# EAGLE design reloadpro (EAGLE 7.3.0)
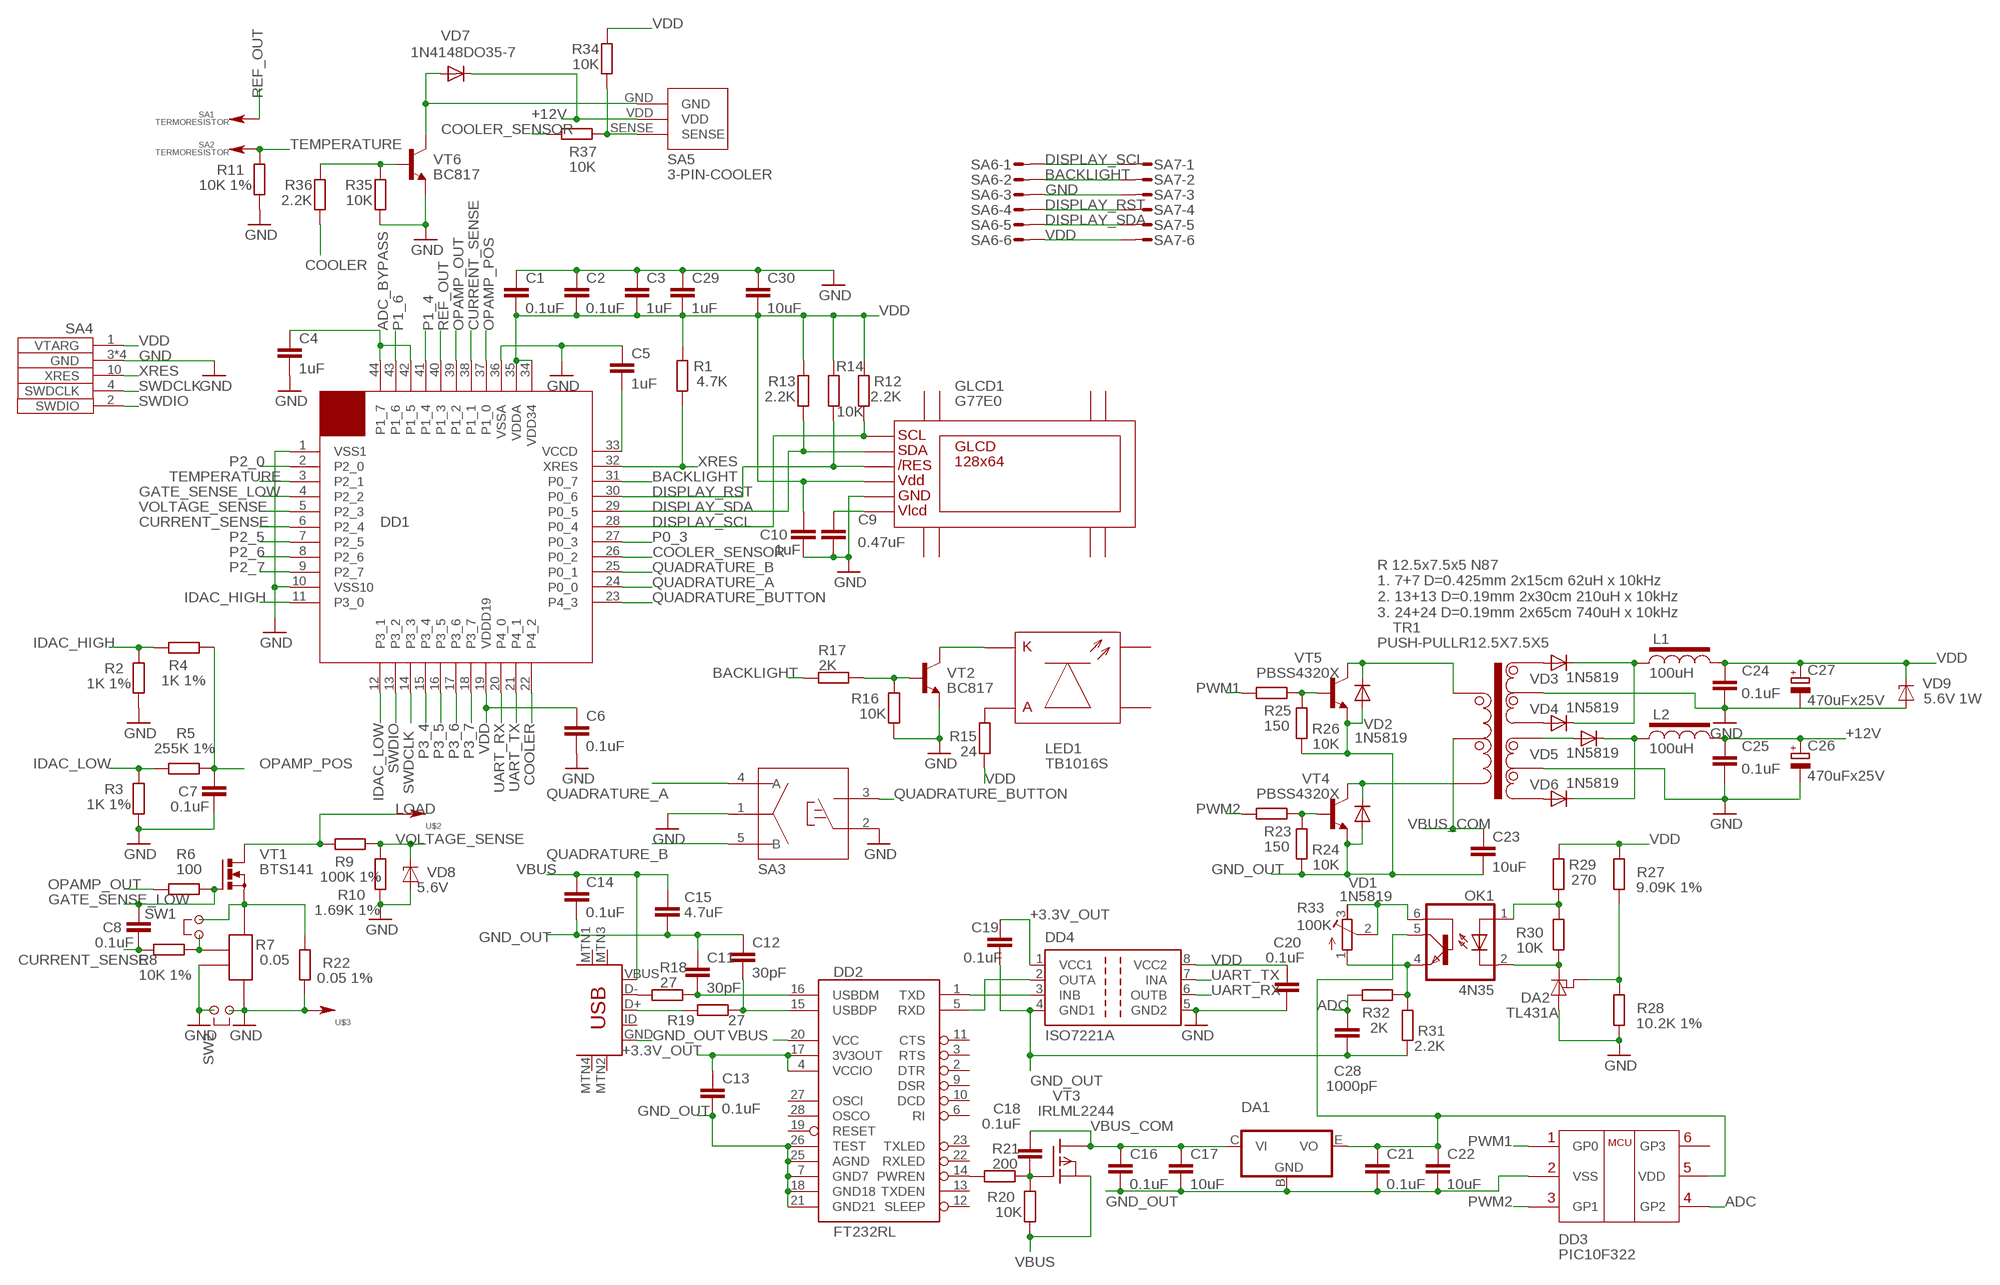
[diagram p0: schematic, sheet 1]

## Parts
C1  0.1uF  C-EUC0603  [C0603]
C2  0.1uF  C-EUC0603  [C0603]
C3  1uF  C-EUC0603  [C0603]
C4  1uF  C-EUC0603  [C0603]
C5  1uF  C-EUC0603  [C0603]
C6  0.1uF  C-EUC0603  [C0603]
C7  0.1uF  C-EUC0603  [C0603]
C8  0.1uF  C-EUC0603  [C0603]
C9  0.47uF  C-EUC1206  [C1206]
C10  1uF  C-EUC0603  [C0603]
C11  30pF  C-EUC0603  [C0603]
C12  30pF  C-EUC0603  [C0603]
C13  0.1uF  C-EUC0603  [C0603]
C14  0.1uF  C-EUC0603  [C0603]
C15  4.7uF  C-EUC0805  [C0805]
C16  0.1uF  C-EUC0603  [C0603]
C17  10uF  C-EUC1206  [C1206]
C18  0.1uF  C-EUC0603  [C0603]
C19  0.1uF  C-EUC0603  [C0603]
C20  0.1uF  C-EUC0603  [C0603]
C21  0.1uF  C-EUC0603  [C0603]
C22  10uF  C-EUC1206  [C1206]
C23  10uF  C-EUC1206  [C1206]
C24  0.1uF  C-EUC0603  [C0603]
C25  0.1uF  C-EUC0805  [C0805]
C26  470uFx25V  CPOL-EUE3.5-8  [E3,5-8]
C27  470uFx25V  CPOL-EUE3.5-8  [E3,5-8]
C28  1000pF  C-EUC0805  [C0805]
C29  1uF  C-EUC0603  [C0603]
C30  10uF  C-EUC0805  [C0805]
DA1  78GOR  [TO92-EBC]
DA2  TL431A  TL431TO92  [TO92-EBC]
DD1  CY8C4245-AXITQFP44  [TQFP44]
DD2  FT232RL  FT232RLSSOP  [SSOP28DB]
DD3  PIC10F322  PIC10F20XSOT23-6  [SOT23-6]
DD4  ISO7221A  [SO-08]
GLCD1  G77E0  [G77E0]
L1  100uH  INDUCTORLGA0410_HOME  [LGA0410]
L2  100uH  INDUCTORLGA0410_HOME  [LGA0410]
LED1  TB1016S  [TB1016S]
OK1  4N35  [DIL06]
R1  4.7K  R-EU_R0603  [R0603]
R2  1K 1%  R-EU_R0603  [R0603]
R3  1K 1%  R-EU_R0603  [R0603]
R4  1K 1%  R-EU_R0603  [R0603]
R5  255K 1%  R-EU_R0805  [R0805]
R6  100  R-EU_R0805  [R0805]
R7  0.05  SR10SR10  [SR10]
R8  10K 1%  R-EU_R0603  [R0603]
R9  100K 1%  R-EU_R0603  [R0603]
R10  1.69K 1%  R-EU_R0805  [R0805]
R11  10K 1%  R-EU_R0603  [R0603]
R12  2.2K  R-EU_R0603  [R0603]
R13  2.2K  R-EU_R0603  [R0603]
R14  10K  R-EU_R0603  [R0603]
R15  24  R-EU_R1206  [R1206]
R16  10K  R-EU_R0603  [R0603]
R17  2K  R-EU_R0603  [R0603]
R18  27  R-EU_R0805  [R0805]
R19  27  R-EU_R0805  [R0805]
R20  10K  R-EU_R0603  [R0603]
R21  200  R-EU_R0603  [R0603]
R22  0.05 1%  R-EU_R2512  [R2512]
R23  150  R-EU_R0805  [R0805]
R24  10K  R-EU_R0603  [R0603]
R25  150  R-EU_R0805  [R0805]
R26  10K  R-EU_R0603  [R0603]
R27  9.09K 1%  R-EU_R0805  [R0805]
R28  10.2K 1%  R-EU_R0805  [R0805]
R29  270  R-EU_R0805  [R0805]
R30  10K  R-EU_R0603  [R0603]
R31  2.2K  R-EU_R0603  [R0603]
R32  2K  R-EU_R0603  [R0603]
R33  100K  R-TRIMM3296H  [RTRIM3296H]
R34  10K  R-EU_R0603  [R0603]
R35  10K  R-EU_R0603  [R0603]
R36  2.2K  R-EU_R0603  [R0603]
R37  10K  R-EU_R0603  [R0603]
SA1  TERMORESISTOR  1-PINHOME  [1-PIN_HOME]
SA2  TERMORESISTOR  1-PINHOME  [1-PIN_HOME]
SA3  PEC16IDC  [PEC16-IDC]
SA4  SWDSMD  [IDC10_1.27SMD]
SA5  3-PIN-COOLER  [3-PIN-COOLER]
SA6  MICROMATCH-6SMD  [MICROMATCH-6SMD]
SA7  MICROMATCH-6SMD  [MICROMATCH-6SMD]
SW1  2-PINDIL  [2-PIN]
SW2  2-PINDIL  [2-PIN]
TR1  PUSH-PULLR12.5X7.5X5  [R12.5X7.5X5PUSHH-PULL]
U$1  USB-MINIB-5PIN  [USB-MINIB]
U$2  1-PIN2_54  [1_PIN_2_54]
U$3  1-PIN2_54  [1_PIN_2_54]
VD1  1N5819  SM5819DO41-10  [DO41-10]
VD2  1N5819  SM5819DO41-10  [DO41-10]
VD3  1N5819  SM5819DO41-10  [DO41-10]
VD4  1N5819  SM5819DO41-10  [DO41-10]
VD5  1N5819  SM5819DO41-10  [DO41-10]
VD6  1N5819  SM5819DO41-10  [DO41-10]
VD7  1N4148DO35-7  [DO35-7]
VD8  5.6V  STABILITRONSMD  [STABILITRON]
VD9  5.6V 1W  STABILITRONDO35-10  [DO35-10]
VT1  BTS141  [TO220BV]
VT2  BC817  BC817-16LT1-NPN-SOT23-BEC  [SOT23-BEC]
VT3  IRLML2244  P-MOSFETSOT23  [SOT23]
VT4  PBSS4320X  -NPN-SOT89-BCE  [SOT89-BCE]
VT5  PBSS4320X  -NPN-SOT89-BCE  [SOT89-BCE]
VT6  BC817  BC817-16LT1-NPN-SOT23-BEC  [SOT23-BEC]

## Nets
+3.3V_OUT: C13.1 C19.1 DD2.4(VCCIO) DD2.17(3V3OUT) DD4.1(VCC1)
+12V: C25.1 C26.+ L2.P$2(L2) SA5.VDD VD7.C
ADC: C28.1 DD3.4(GP2) R32.1
ADC_BYPASS: C4.1 DD1.42(P1_5) DD1.44(P1_7)
BACKLIGHT: DD1.31(P0_7) R17.2 SA6.2 SA7.2
COOLER: DD1.22(P4_2) R36.1
COOLER_SENSOR: DD1.26(P0_2) R37.2
CURRENT_SENSE: C8.2 DD1.6(P2_4) DD1.38(P1_1) R8.2
DISPLAY_RST: DD1.30(P0_6) GLCD1./RES R14.1 SA6.4 SA7.4
DISPLAY_SCL: DD1.28(P0_4) GLCD1.SCL R12.1 SA6.1 SA7.1
DISPLAY_SDA: DD1.29(P0_5) GLCD1.SDA R13.1 SA6.5 SA7.5
GATE_SENSE_LOW: C8.1 DD1.4(P2_2) R6.1 VT1.G
GND: C1.1 C2.1 C3.1 C4.2 C5.1 C6.2 C7.2 C9.2 C10.2 C20.2 C24.2 C25.2 C26.- C27.- C29.1 C30.1 DA2.B(A) DD1.1(VSS1) DD1.10(VSS10) DD1.36(VSSA) DD4.5(GND2) GLCD1.GND R2.1 R3.1 R7.1 R7.2 R10.2 R11.1 R16.1 R22.2 R28.2 R35.1 SA3.1(C) SA3.2(B2) SA4.3(GND) SA4.5(GND) SA4.7(GND) SA4.9(GND) SA6.3 SA7.3 SW2.1 SW2.2 TR1.W2-COM TR1.W2-COM1(W2-COM) TR1.W3-COM TR1.W3-COM1(W3-COM) U$3.P$1(S) VD8.A VD9.A VT2.E VT6.E
GND_OUT: C11.1 C12.1 C13.2 C14.2 C15.2 C16.2 C17.2 C19.2 C21.2 C22.2 C23.2 C28.2 DA1.B(GND) DD2.7(GND7) DD2.18(GND18) DD2.21(GND21) DD2.25(AGND) DD2.26(TEST) DD3.2(VSS) DD4.4(GND1) R24.1 R26.1 R31.2 U$1.GND VD1.A VD2.A VT4.E VT5.E
IDAC_HIGH: DD1.11(P3_0) R2.2 R4.2
IDAC_LOW: DD1.12(P3_1) R3.2 R5.2
LOAD: R9.2 U$2.P$1(S) VT1.D
N$1: C5.2 DD1.33(VCCD)
N$2: R7.4 R22.1 SW1.2 VT1.S
N$3: R7.3 R8.1 SW1.1
N$4: LED1.A R15.1
N$5: LED1.K VT2.C
N$6: R16.2 R17.1 VT2.B
N$7: R18.1 U$1.D-
N$8: C11.2 DD2.16(USBDM) R18.2
N$9: C9.1 GLCD1.VLCD
N$10: R19.1 U$1.D+
N$11: C12.2 DD2.15(USBDP) R19.2
N$12: DD2.1(TXD) DD4.3(INB)
N$13: DD2.5(RXD) DD4.2(OUTA)
N$15: DD2.14(PWREN) R21.2
N$16: C18.1 R20.2 R21.1 VT3.1(G)
N$17: C21.1 C22.1 DA1.E(VO) DD3.5(VDD) OK1.5(COL)
N$18: R23.2 R24.2 VT4.B
N$19: R34.1 R37.1 SA5.SENSE
N$21: R25.2 R26.2 VT5.B
N$22: TR1.W2-1 VD3.A
N$23: TR1.W2-2 VD4.A
N$24: TR1.W3-2 VD6.A
N$25: TR1.W3-1 VD5.A
N$26: L1.P$1(L1) VD3.C VD4.C
N$27: L2.P$1(L1) VD5.C VD6.C
N$28: DA2.E(REF) R27.2 R28.1
N$29: OK1.1(A) R29.2 R30.1
N$30: DA2.C OK1.2(C) R30.2
N$31: OK1.4(EMI) R31.1 R32.2 R33.1(E)
N$32: OK1.6(BAS) R33.2(S) R33.3(A)
N$33: R35.2 R36.2 VT6.B
N$34: SA5.GND VD7.A VT6.C
OPAMP_OUT: DD1.39(P1_2) R6.2
OPAMP_POS: C7.1 DD1.37(P1_0) R4.1 R5.1
P0_3: DD1.27(P0_3)
P1_4: DD1.41(P1_4)
P1_6: DD1.43(P1_6)
P2_0: DD1.2(P2_0)
P2_5: DD1.7(P2_5)
P2_6: DD1.8(P2_6)
P2_7: DD1.9(P2_7)
P3_4: DD1.15(P3_4)
P3_5: DD1.16(P3_5)
P3_6: DD1.17(P3_6)
P3_7: DD1.18(P3_7)
PWM1: DD3.1(GP0) R25.1
PWM1PWR: TR1.W1-1 VD2.C VT5.C
PWM2: DD3.3(GP1) R23.1
PWM2PWR: TR1.W1-2 VD1.C VT4.C
QUADRATURE_A: DD1.24(P0_0) SA3.4(A)
QUADRATURE_B: DD1.25(P0_1) SA3.5(B)
QUADRATURE_BUTTON: DD1.23(P4_3) SA3.3(B1)
REF_OUT: DD1.40(P1_3) SA1.P$1(S)
SWDCLK: DD1.14(P3_3) SA4.4(SWDCLK)
SWDIO: DD1.13(P3_2) SA4.2(SWDIO)
TEMPERATURE: DD1.3(P2_1) R11.2 SA2.P$1(S)
UART_RX: DD1.20(P4_0) DD4.6(OUTB)
UART_TX: DD1.21(P4_1) DD4.7(INA)
VBUS: C14.1 C15.1 DD2.20(VCC) R20.1 U$1.VBUS VT3.2(S)
VBUS_COM: C16.1 C17.1 C18.2 C23.1 DA1.C(VI) TR1.W1-COM TR1.W1-COM1(W1-COM) VT3.3(D)
VDD: C1.2 C2.2 C3.2 C6.1 C10.1 C20.1 C24.1 C27.+ C29.2 C30.2 DD1.19(VDDD19) DD1.34(VDD34) DD1.35(VDDA) DD4.8(VCC2) GLCD1.VDD L1.P$2(L2) R1.2 R12.2 R13.2 R14.2 R15.2 R27.1 R29.1 R34.2 SA4.1(VTARG) SA6.6 SA7.6 VD9.C
VOLTAGE_SENSE: DD1.5(P2_3) R9.1 R10.1 VD8.C
XRES: DD1.32(XRES) R1.1 SA4.10(XRES)
Unconnected: DD2.2(DTR) DD2.3(RTS) DD2.6(RI) DD2.9(DSR) DD2.10(DCD) DD2.11(CTS) DD2.12(SLEEP) DD2.13(TXDEN) DD2.19(RESET) DD2.22(RXLED) DD2.23(TXLED) DD2.27(OSCI) DD2.28(OSCO) DD3.6(GP3) GLCD1.NC1 GLCD1.NC2 GLCD1.NC3 GLCD1.NC4 GLCD1.NC5 GLCD1.NC6 GLCD1.NC7 GLCD1.NC8 LED1.NC1 LED1.NC2 U$1.ID U$1.MTN1(MTN2) U$1.MTN2(MTN3) U$1.MTN3(MTN1) U$1.MTN4

## Notes on the sheet
- R 12.5x7.5x5 N87
  1. 7+7 D=0.425mm 2x15cm 62uH x 10kHz
  2. 13+13 D=0.19mm 2x30cm 210uH x 10kHz
  3. 24+24 D=0.19mm 2x65cm 740uH x 10kHz

## Library data of the parts
C1-C25 C28-C30 = resistors:C-EU: CAPACITOR, European symbol
C26 C27 = resistors:CPOL-EU: POLARIZED CAPACITOR, European symbol
DA1 = power:78*: Positive VOLTAGE REGULATOR Source: http://cache.national.com/ds/LM/LM78L05.pdf http://www.fairchildsemi.com/ds/LM/LM7805.pdf
DA2 = power:TL431
DD1 = cypress:CY8C4245-AXI
DD2 = interface_ic:FT232RL: FT232RL USB UART FT232RL 4th Generation USB UART (USB <-> Serial) Controller. Datasheet <http://www.sparkfun.com/datasheets/IC/FT232R_v104.pdf> SparkFun Products Component <https://www.sparkfun.com/products/650> (COM-00650) SparkFun RedBot Mainboard <https://www.sparkfun.com/products/12097> (ROB-12097) SparkFun FTDI Basic Breakout - 5V <https://www.sparkfun.com/products/9716> (DEV-09716) SparkFun FTDI Basic Breakout - 3.3V <https://www.sparkfun.com/products/9873> (DEV-09873) Bus Pirate - v3.6a <https://www.sparkfun.com/products/12942> (TOL-12942) SparkFun USB to Serial Breakout - FT232RL <https://www.sparkfun.com/products/12731> (BOB-12731) SparkFun PicoBoard <https://www.sparkfun.com/products/11888> (WIG-11888) SparkFun RFID USB Reader <https://www.sparkfun.com/products/9963> (SEN-09963) LilyPad FTDI Basic Breakout - 5V <https://www.sparkfun.com/products/10275> (DEV-10275) SparkFun Stepoko <https://www.sparkfun.com/products/13899> (ROB-13899); PROD_ID: IC-00870
DD3 = Microchip:PIC10F20X
DD4 = texas:ISO7221: DUAL DIGITAL ISOLATORS Source: http://focus.ti.com/lit/ds/symlink/iso7221a.pdf; MPN: ISO7221AD; OC_FARNELL: 1390651; OC_NEWARK: 48M0672
GLCD1 = lcd:G77E0
L1 L2 = inductors:INDUCTOR
LED1 = lcd:TB1016S
OK1 = optocoupler:4N35: MOTOROLA OPTO COUPLER; MF: FAIRCHILD SEMICONDUCTOR; MPN: 4N35; OC_FARNELL: 1328375; OC_NEWARK: 72K9946
R1-R6 R8-R32 R34-R37 = resistors:R-EU_: RESISTOR, European symbol
R7 = resistors:SR10
R33 = resistors:R-TRIMM: Trimm resistor
SA1 SA2 U$2 U$3 = connectors:1-PIN
SA3 = encoders:PEC16
SA4 = cypress:SWD
SA5 = connectors:3-PIN-COOLER
SA6 SA7 = connectors:MICROMATCH-6: MicroMaTch 6 7-215464-6 / 0-215464-6 Drawing Number C-215464 DDEController.pdf
SW1 SW2 = connectors:2-PIN
TR1 = inductors:PUSH-PULLR12.5X7.5X5
U$1 = connectors:USB-MINIB: Mini-USB "B" connector with 5th pin broken out. Created new symbol breaking out 5th "ID" pin in mini/micro USB connector spec. See: http://en.wikipedia.org/wiki/Mini_usb#Cables. Uses same footprint as 4-pin symbol. Also added pins to connect to mounting / shield pads if required (probably not generally needed as signals aren't shielded once they leave the connector).
VD1-VD6 = diodes:SM5819
VD7 = diodes:1N4148: DIODE high speed (Philips)
VD8 VD9 = diodes:STABILITRON
VT1 = Tranzistors:BTS141
VT2 VT4-VT6 = Tranzistors:*-NPN-: NPN Transistror BF959 corrected 2008.03.06
VT3 = Tranzistors:P-MOSFET

## Board
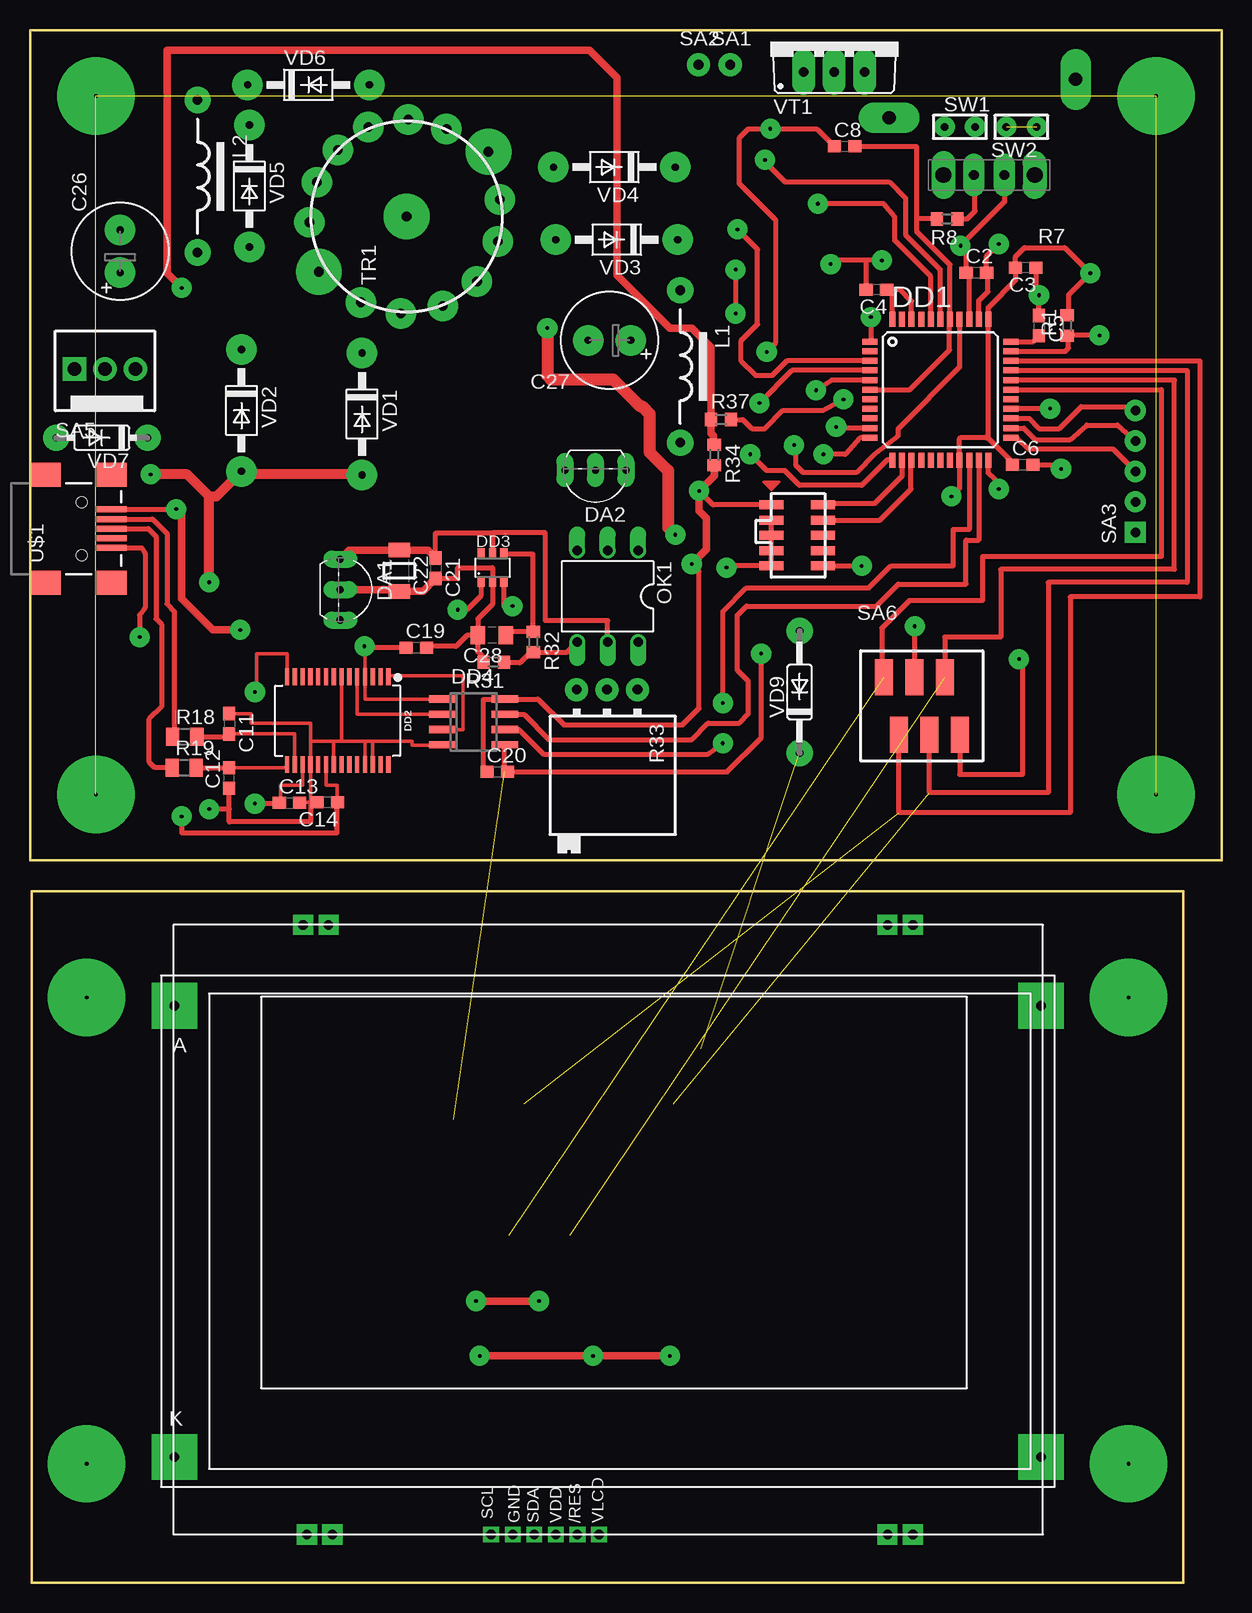
[diagram p1: board, top side]
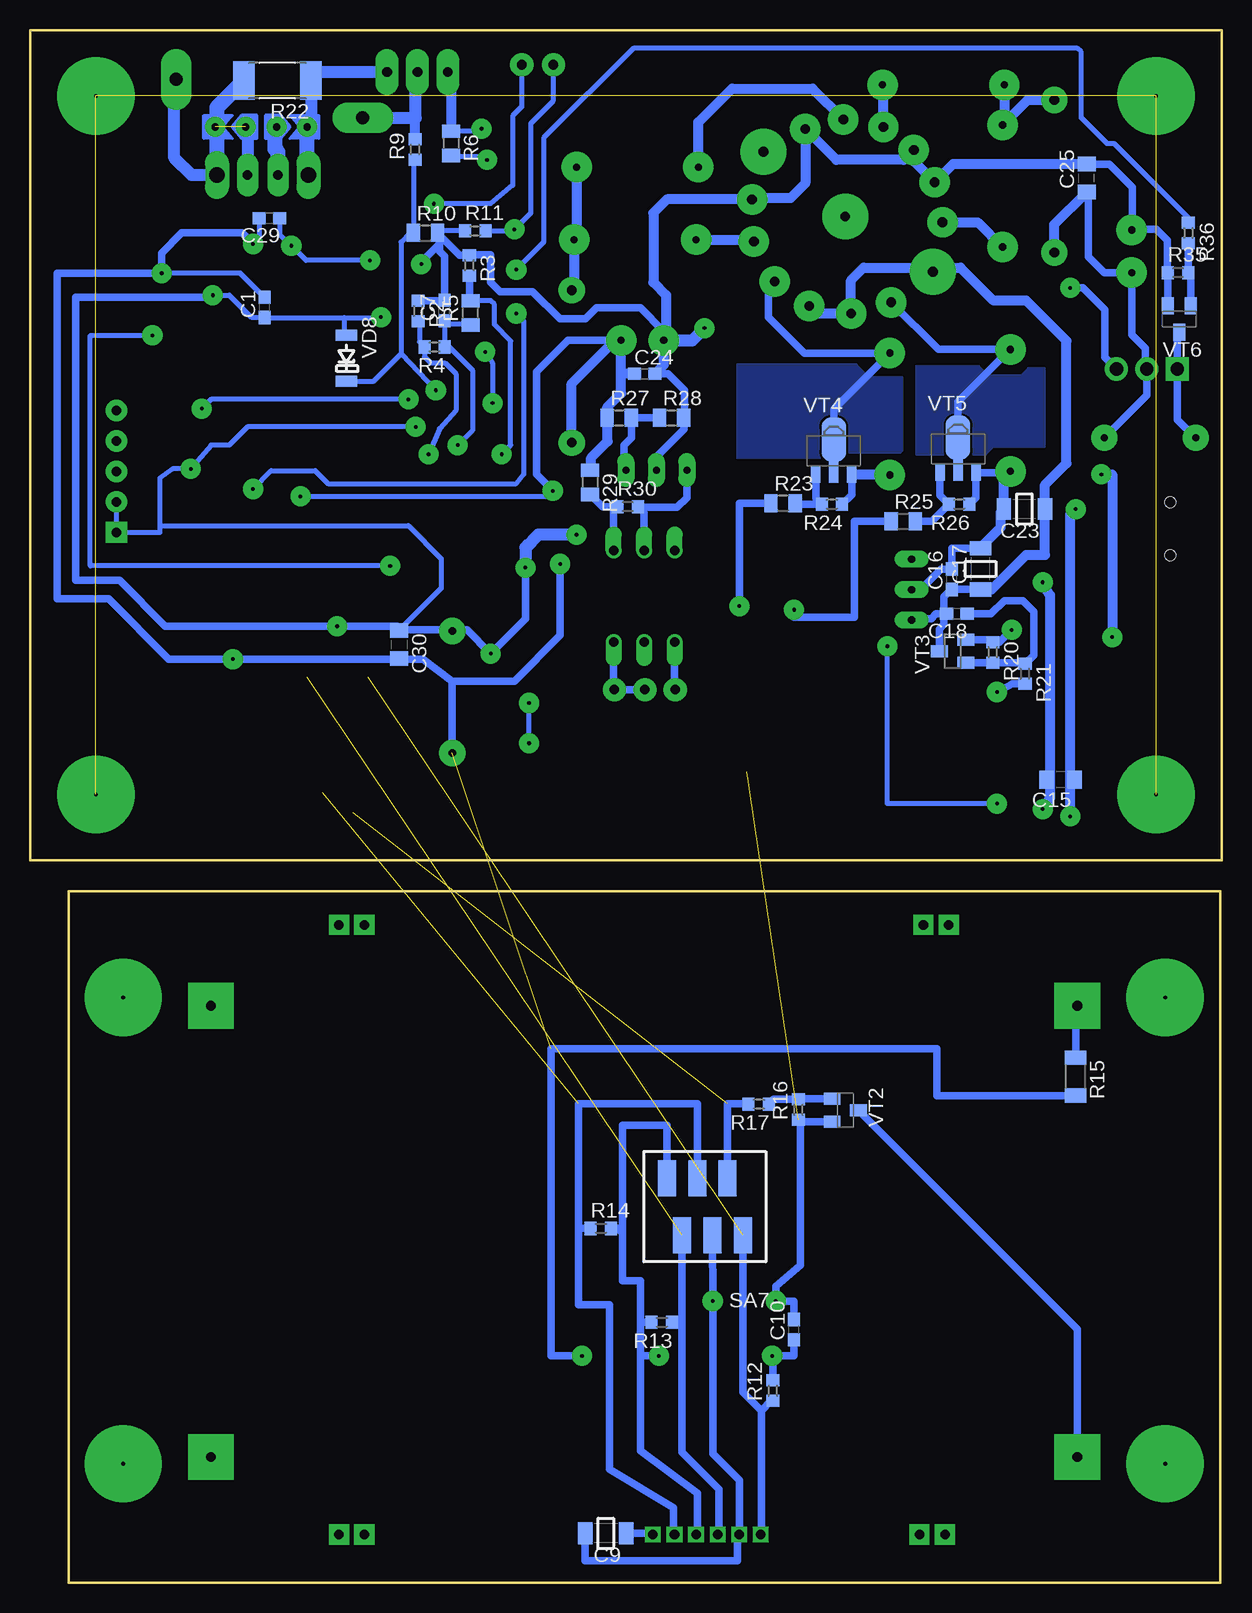
[diagram p2: board, bottom side, seen from below]

Size 99.36 x 129.39 mm. Coordinates in mm from the lower left corner, seen from the top.
Outline: 0.15,0 96.14,0 96.14,57.63 0.15,57.63 0.15,0
Outline: 0,129.39 99.36,129.39 99.36,60.2 0,60.2 0,129.39
Copper layers (1*16): Top 0.035mm / dielectric 1.5mm / Bottom 0.035mm
Design rules "default *": minimum track width 10mil, minimum drill 24mil, track to track 8mil, track to pad 8mil, pad to pad 8mil, via to via 8mil, smd to smd 8mil, copper to edge 40mil, drill to drill 8mil, minimum pad ring 10mil, minimum via ring 8mil, stop-mask expansion 4mil, vias tented up to drill 0mil, thermal gap 10mil

### Footprints (pad centres in the part's own frame; a part is rotated, then mirrored left to right if it is on the bottom)
C0603 = smd 1.1 x 1: 1 -0.85,0; 2 0.85,0
C1206 = smd 1.2 x 1.8: 1 -1.718,0; 2 1.718,0
C0805 = smd 1.2 x 1.5: 1 -1.167,0; 2 1.167,0
E3,5-8 = drill 0.6 pad 2.54: + -1.778,0; - 1.778,0
TO92-EBC = drill 0.6 pad 1.422 long: B 0,-1.27; C 2.54,-1.27; E -2.54,-1.27
TQFP44 = smd 1.25 x 0.5: 1 -5.879,4; 2 -5.879,3.2; 3 -5.879,2.4; 4 -5.879,1.6; 5 -5.879,0.8; 6 -5.879,0; 7 -5.879,-0.8; 8 -5.879,-1.6; 9 -5.879,-2.4; 10 -5.879,-3.2; 11 -5.879,-4; 23 5.879,-4; 24 5.879,-3.2; 25 5.879,-2.4; 26 5.879,-1.6; 27 5.879,-0.8; 28 5.879,0; 29 5.879,0.8; 30 5.879,1.6; 31 5.879,2.4; 32 5.879,3.2; 33 5.879,4 | smd 0.5 x 1.25: 12 -4,-5.879; 13 -3.2,-5.879; 14 -2.4,-5.879; 15 -1.6,-5.879; 16 -0.8,-5.879; 17 0,-5.879; 18 0.8,-5.879; 19 1.6,-5.879; 20 2.4,-5.879; 21 3.2,-5.879; 22 4,-5.879; 34 4,5.879; 35 3.2,5.879; 36 2.4,5.879; 37 1.6,5.879; 38 0.8,5.879; 39 0,5.879; 40 -0.8,5.879; 41 -1.6,5.879; 42 -2.4,5.879; 43 -3.2,5.879; 44 -4,5.879
SSOP28DB = smd 0.348 x 1.397: 1 -4.225,-3.656; 2 -3.575,-3.656; 3 -2.925,-3.656; 4 -2.275,-3.656; 5 -1.625,-3.656; 6 -0.975,-3.656; 7 -0.325,-3.656; 8 0.325,-3.656; 9 0.975,-3.656; 10 1.625,-3.656; 11 2.275,-3.656; 12 2.925,-3.656; 13 3.575,-3.656; 14 4.225,-3.656; 15 4.225,3.656; 16 3.575,3.656; 17 2.925,3.656; 18 2.275,3.656; 19 1.625,3.656; 20 0.975,3.656; 21 0.325,3.656; 22 -0.325,3.656; 23 -0.975,3.656; 24 -1.625,3.656; 25 -2.275,3.656; 26 -2.925,3.656; 27 -3.575,3.656; 28 -4.225,3.656
SOT23-6 = smd 0.6 x 0.9: 1 -0.95,-1.15; 2 0,-1.15; 3 0.95,-1.15; 4 0.95,1.15; 5 0,1.15; 6 -0.95,1.15
SO-08 = smd 0.6 x 2.2: 1 -1.905,-2.6; 2 -0.635,-2.6; 3 0.635,-2.6; 4 1.905,-2.6; 5 1.905,2.6; 6 0.635,2.6; 7 -0.635,2.6; 8 -1.905,2.6
G77E0 = drill 0.8 pad 1.27 square: /RES 33.7,0; GND 28.3,0; SCL 26.5,0; SDA 30.1,0; VDD 31.9,0; VLCD 35.5,0 | drill 0.8 pad 1.676 square: NC1 10.832,50.8; NC2 12.95,50.8; NC3 59.55,50.8; NC4 61.667,50.8; NC5 11.15,0; NC6 13.268,0; NC7 59.55,0; NC8 61.667,0
LGA0410 = drill 0.8 pad 2.184: P$1 0,0; P$2 12.7,0
TB1016S = drill 0.8 pad 3.81 square: A 1.13,40.1; K 1.13,2.5; NC1 73.37,40.1; NC2 73.37,2.5
DIL06 = drill 0.813 offset: 1 -2.54,-3.81; 2 0,-3.81; 3 2.54,-3.81; 4 2.54,3.81; 5 0,3.81; 6 -2.54,3.81
R0603 = smd 1 x 1.1: 1 -0.85,0; 2 0.85,0
R0805 = smd 1.1 x 1.5: 1 -1.009,0; 2 1.009,0
SR10 = drill 1.3 pad 2 long: 1 -3.81,0; 4 3.81,0 | drill 0.8 pad 1.778 long: 2 -1.27,0; 3 1.27,0
R1206 = smd 1.2 x 1.803: 1 -1.581,0; 2 1.581,0
R2512 = smd 1.8 x 3.2: 1 -2.8,0; 2 2.8,0
RTRIM3296H = drill 0.8 pad 1.93: 1 0,0; 2 0,2.54; 3 0,5.08
1-PIN_HOME = drill 0.8 pad 1.93: P$1 0,0
PEC16-IDC = drill 0.8 pad 1.778 square: 1 0,0 | drill 0.8 pad 1.778: 2 2.54,0; 3 5.08,0; 4 7.62,0; 5 10.16,0
IDC10_1.27SMD = smd 0.75 x 2: 1 5.08,4.128; 2 5.08,-0.159; 3 3.81,4.128; 4 3.81,-0.159; 5 2.54,4.128; 6 2.54,-0.159; 7 1.27,4.128; 8 1.27,-0.159; 9 0,4.128; 10 0,-0.159
3-PIN-COOLER = drill 1.1 pad 1.93 square: GND 0,0 | drill 1.1 pad 1.93: SENSE 5.08,0; VDD 2.54,0
MICROMATCH-6SMD = smd 1.5 x 3: 1 0,0; 2 1.27,-4.763; 3 2.54,0; 4 3.81,-4.763; 5 5.08,0; 6 6.35,-4.763
2-PIN = drill 0.6 pad 1.676: 1 0,0; 2 2.54,0
R12.5X7.5X5PUSHH-PULL = drill 0.8 pad 3.81: P$1 0,0; P$2 5.397,-6.826; P$3 -4.604,7.303 | drill 0.8 pad 2.54: W1-1 -7.144,3.81; W1-2 -5.397,-5.874; W1-COM -8.096,0.476; W1-COM1 -7.461,-3.016; W2-1 -2.064,-7.62; W2-2 8.096,-0.159; W2-COM 1.429,-7.779; W2-COM1 7.303,-3.334; W3-1 -0.476,8.096; W3-2 7.461,3.175; W3-COM 2.857,7.461; W3-COM1 5.556,5.715
USB-MINIB = smd 2.5 x 0.5: D+ 2.5,0; D- 2.5,0.8; GND 2.5,-1.6; ID 2.5,-0.8; VBUS 2.5,1.6 | smd 2.5 x 2: MTN1 -3,4.5; MTN2 2.5,4.5; MTN3 -3,-4.5; MTN4 2.5,-4.5 | hole 0.9: 0,2.2; 0,-2.2
1_PIN_2_54 = drill 1.1 pad 2.54 long: P$1 0,0
DO41-10 = drill 0.6 pad 2.54: A 5.08,0; C -5.08,0
DO35-7 = drill 0.6 pad 2.184: A 3.81,0; C -3.81,0
STABILITRON = smd 0.914 x 1.778: A 0,0; C 3.81,0
DO35-10 = drill 0.6 pad 2.184: A 5.08,0; C -5.08,0
TO220BV = drill 0.8 pad 1.93 long: D 0,-2.54; G -2.54,-2.54; S 2.54,-2.54
SOT23-BEC = smd 1 x 1.4: B -0.95,-1.1; C 0,1.1; E 0.95,-1.1
SOT23 = smd 1 x 1.4: 1 -0.95,-1.1; 2 0.95,-1.1; 3 0,1.1
SOT89-BCE = smd 0.8 x 1.4: B -1.499,-1.981; E 1.499,-1.981 | smd 0.8 x 1.9: C 0,-1.727 | smd 2.032 x 3.65: C@1 0,0.94

### Placement (x,y rotation side)
C1  79.81,106.27 90 bottom
C2  78.89,109.17 0 top
C3  83.01,109.58 180 top
C4  70.56,107.75 180 top
C5  84.12,104.75 270 top
C6  82.75,93.17 0 top
C7  64.82,106.02 90 bottom
C8  67.92,119.68 0 top
C9  51.36,4.11 180 bottom
C10  35.66,21.08 90 bottom
C11  16.61,71.58 270 top
C12  16.61,67.06 90 top
C13  21.64,64.97 0 top
C14  24.79,65.02 180 top
C15  13.44,66.9 180 bottom
C16  22.5,83.62 90 bottom
C17  20.12,84.48 90 bottom
C18  22.1,80.72 180 bottom
C19  32.21,77.93 0 top
C20  38.96,67.56 0 top
C21  33.83,84.53 270 top
C22  30.78,84.33 270 top
C23  16.46,89.46 180 bottom
C24  48.11,100.74 0 bottom
C25  11.28,117.04 90 bottom
C26  7.52,110.95 90 top
C27  48.31,103.53 180 top
C28  38.51,78.94 180 top
C29  79.4,113.69 180 bottom
C30  68.58,78.18 270 bottom
DA1  27.13,82.75 270 top
DA2  47.14,91.44 180 top
DD1  75.9,99.42 0 top
DD2  25.65,71.83 180 top
DD3  38.56,84.58 0 top
DD4  36.98,71.73 270 top
GLCD1  11.94,4.01 0 top
L1  54.2,107.7 270 top
L2  13.97,123.55 270 top
LED1  10.92,7.98 0 top
OK1  48.16,82.19 180 top
R1  86.46,104.75 90 top
R2  67.01,105.97 270 bottom
R3  62.74,109.78 270 bottom
R4  65.63,102.97 180 bottom
R5  62.64,105.82 90 bottom
R6  64.26,119.94 270 bottom
R7  79.96,117.3 180 top
R8  76.45,113.64 180 top
R9  67.26,119.43 90 bottom
R10  66.4,112.47 0 bottom
R11  62.24,112.65 0 bottom
R12  37.44,16 90 bottom
R13  46.69,21.69 180 bottom
R14  51.77,29.51 0 bottom
R15  12.19,42.16 270 bottom
R16  35.31,39.42 90 bottom
R17  38.61,39.88 180 bottom
R18  12.9,70.51 0 top
R19  12.85,67.92 0 top
R20  19.1,77.52 270 bottom
R21  16.41,75.74 270 bottom
R22  78.74,125.17 180 bottom
R23  36.58,89.97 0 bottom
R24  32.51,89.87 180 bottom
R25  26.57,88.44 0 bottom
R26  21.89,89.87 180 bottom
R27  50.24,97.08 0 bottom
R28  45.87,97.08 0 bottom
R29  52.68,91.69 270 bottom
R30  49.53,89.66 0 bottom
R31  38.66,76.71 180 top
R32  41.96,78.38 270 top
R33  45.57,74.42 270 top
R34  57.05,93.98 270 top
R35  3.66,109.17 0 bottom
R36  2.79,112.47 270 bottom
R37  57.61,96.93 0 top
SA1  58.37,126.49 0 top
SA2  55.73,126.49 0 top
SA3  92.15,87.53 90 top
SA4  65.94,84.73 90 top
SA5  3.71,101.14 0 top
SA6  71.17,75.44 0 top
SA7  39.93,28.96 180 bottom
SW1  78.79,121.31 180 top
SW2  81.38,121.31 0 top
TR1  31.39,113.84 90 top
U$1  4.32,87.83 0 top
U$2  71.63,122.07 90 top
U$3  87.17,125.27 180 top
VD1  27.69,97.38 270 top
VD2  17.63,97.69 270 top
VD3  48.92,111.91 180 top
VD4  48.72,117.96 180 top
VD5  18.29,116.38 270 top
VD6  23.22,124.82 0 top
VD7  5.99,95.4 180 top
VD8  73,103.94 270 bottom
VD9  64.16,74.22 90 top
VT1  67.06,128.42 0 top
VT2  31.39,39.37 270 bottom
VT3  22.45,77.62 90 bottom
VT4  32.36,94.34 0 bottom
VT5  22,94.49 0 bottom
VT6  3.56,105.31 180 bottom

### Tracks (layer width: path | path; a pad name or v marks a point on that pad's centre or on a via)
+3.3V_OUT  (via drill 0.3 pad 1.68)
  Top 0.305: DD4.1 27.93,73.64 DD2.4 27.93,78.03 v27.89,78.03 | DD2.17 22.73,66.45 20.88,66.45 20.88,64.97 C13.1
  Top 0.406: C13.1 20.79,64.92 v18.75,64.92 | C19.1 27.99,77.93 v27.89,78.03
  Bottom 0.406: v18.75,64.92 27.89,64.92 v27.89,78.03
+12V
  Bottom 0.61: C25.1 11.13,115.72 11.13,110.49 9.8,109.17 C26.+ 7.52,103.99 6.4,102.87 6.4,101.3 SA5.VDD 6.25,98.96 VD7.C
  Bottom 0.813: L2.P$2 13.97,113.18 C25.1
ADC
  Top 0.406: DD3.4 41.91,85.73 41.91,79.28 R32.1 39.97,79.23 C28.1
ADC_BYPASS
  Top 0.406: DD1.44 71.9,107.26 C4.1 72.54,107.75 73.5,106.79 DD1.42
BACKLIGHT  (1 unrouted)
  Top 0.406: DD1.31 97.54,101.82 97.54,82.14 86.72,82.14 86.72,64.16 72.44,64.16 SA6.2
  Bottom 0.61: SA7.2 41.2,39.93 39.46,39.93 R17.2
COOLER  (via drill 0.3 pad 1.68)
  Top 0.406: v80.77,91.14 80.47,91.9 79.9,92.47 DD1.22 | v58.83,109.42 v58.83,105.77
  Bottom 0.406: v80.77,91.14 79.25,92.66 75.59,92.66 74.52,91.59 58.83,91.59 58.22,92.35 58.22,105.16 v58.83,105.77 | v58.83,109.42 56.54,111.71 56.54,120.4 49.07,127.86 12.04,127.86 11.73,127.56 11.73,122.07 9.6,119.94 8.99,119.94 2.79,113.74 R36.1
COOLER_SENSOR  (via drill 0.3 pad 1.68)
  Top 0.406: v85.04,97.84 81.8,97.84 DD1.26 | v67.82,98.6 66.14,97.69 62.79,97.69 61.26,96.16 60.2,96.16 59.44,96.93 R37.2
  Bottom 0.406: v67.82,98.6 84.28,98.6 v85.04,97.84
CURRENT_SENSE
  Top 0.406: DD1.6 73.36,99.42 76.66,102.72 76.66,105.26 DD1.38 76.7,109.84 73.91,112.62 73.91,113.69 | C8.2 73.91,119.69 73.91,113.69 | R8.2 73.96,113.64 73.91,113.69
DISPLAY_RST  (1 unrouted)
  Top 0.406: DD1.30 96.47,101.02 96.47,83.36 84.89,83.36 84.89,65.84 74.98,65.84 SA6.4
  Bottom 0.61: SA7.4 43.74,39.93 53.64,39.93 53.64,29.57 | 53.64,29.57 53.64,23.16 51.05,23.16 51.05,9.45 45.72,6.25 45.72,4.09 GLCD1./RES | R14.1 53.59,29.52 53.64,29.57
DISPLAY_SCL  (1 unrouted)
  Top 0.406: DD1.28 94.34,99.42 94.34,85.5 79.4,85.5 79.4,81.84 73.3,81.84 71.02,79.55 71.02,75.59 SA6.1
  Bottom 0.61: SA7.1 39.93,15.85 38.4,14.33 | 38.4,14.33 38.4,4.05 GLCD1.SCL | R12.1 37.58,15.15 38.4,14.33
DISPLAY_SDA  (1 unrouted)
  Top 0.406: DD1.29 95.4,100.22 95.4,84.43 80.92,84.43 80.92,78.79 76.25,78.79 SA6.5
  Bottom 0.61: SA7.5 45.01,21.64 | 45.01,21.64 45.01,10.87 41.91,7.77 41.91,4.14 GLCD1.SDA | R13.1 45.06,21.69 45.01,21.64
GATE_SENSE_LOW  (via drill 0.3 pad 1.68)
  Top 0.406: DD1.4 63.53,101.02 v60.81,98.3 | v61.42,102.56 62.18,103.33 62.18,113.54 59.13,116.59 59.13,120.4 59.89,121.16 v61.72,121.16 65.6,121.16 C8.1
  Bottom 0.406: v61.42,102.56 60.81,101.65 v60.81,98.3 | v61.72,121.16 61.93,120.95 R6.1
  Bottom 0.813: VT1.G 64.26,125.63 R6.1
GND  (via drill 0.3 pad 1.68)  (2 unrouted)
  Top 0.406: DD4.5 39.58,67.56 C20.2 58.12,67.56 60.96,70.41 v60.96,77.42 | SA4.3 SA4.5 SA4.7 SA4.9 58.22,84.73 v58.06,84.58 | 78.33,105.26 DD1.36 78.3,108.92 C2.1 78.04,110.93 v77.57,111.4 81.23,115.06 R7.2 | C5.1 v84.12,107.29 83.86,107.56 C3.1 | DD1.10 67.31,96.22 v67.21,96.32 | v70.1,105.46 70.1,103.5 DD1.1 | v71.02,110.19 69.65,110.19 | 69.65,110.19 67.06,110.19 v66.75,109.88 | C4.2 69.71,110.12 69.65,110.19 | C6.2 85.6,93.17 v85.95,92.81 | SA6.3 73.76,75.44 v73.76,79.7
  Top 0.61: v42.44,23.47 v37.19,23.47
  Top 1.016: v43.13,104.55 43.13,100.58 43.43,100.28 48.62,100.28 50.9,97.99 51.05,97.99 51.66,97.38 51.66,94.18 53.19,92.66 53.19,87.94 v53.8,87.33
  Bottom 0.406: 88.54,88.09 88.54,92.05 87.48,92.81 v85.95,92.81 84.28,94.79 82.75,94.79 81.23,96.32 v67.21,96.32 | 88.54,88.09 88.54,87.53 SA3.1 SA3.2 | R11.1 65.2,112.65 R10.2 | v71.02,110.19 76.35,110.19 v77.57,111.4 78.55,112.38 C29.1 | 58.06,86.72 58.06,86.26 | 68.73,79.7 68.58,79.55 68.58,79.4 C30.1 65.07,82.85 65.07,85.34 67.82,88.09 88.54,88.09 | v84.12,107.29 82.75,107.29 80.92,105.46 79.84,105.46 C1.1 73.15,105.42 | 73.15,105.42 70.14,105.42 v70.1,105.46 | VD8.A 73.15,103.94 73.15,105.42
  Bottom 0.61: SA7.3 v42.44,23.47 42.44,10.74 40.23,8.53 GLCD1.GND 40.39,4.01 40.39,1.83 53.08,1.83 C9.2 | C10.2 35.66,23.47 v37.19,23.47 37.19,24.69 35.16,26.47 35.16,38.42 | DA2.B 47.09,92.76 47.09,93.88 44.86,96.11 R28.2 44.81,97.14 44.81,99.36 46.18,100.74 C24.2 | C27.- 46.53,104.29 48.46,106.22 52.12,106.22 53.04,105.31 55.17,105.31 57.45,107.59 60.2,107.59 60.96,108.36 60.96,110.64 62.72,110.64 R3.1 63.54,110.63 65,112.09 | C25.2 9.4,118.21 7.47,116.28 7.47,112.78 | 7.47,112.78 C26.- | VT6.E R35.1 4.57,109.23 4.57,111.86 5.49,112.78 7.47,112.78 | SW2.2 83.92,120.24 83.77,120.09 | 65,112.09 R10.2 | R2.1 64.87,106.82 C7.2 64.82,110.54 65.23,110.95 65.23,111.56 | 68.73,79.7 v73.76,79.7 88.09,79.7 91.9,83.52 95.55,83.52 95.55,107.14 84.28,107.14 v84.12,107.29 | v58.06,84.58 58.06,80.31 v60.96,77.42 62.94,79.4 64.16,79.4 | 65.23,111.56 65.23,111.86 65,112.09 | v66.75,109.88 66.75,110.03 65.23,111.56 | 68.58,79.4 64.16,79.4 | R16.1 35.16,38.42 | 35.16,38.42 VT2.E | VD9.A 64.16,79.4
  Bottom 0.813: C24.2 46.53,101.46 C27.- 46.33,103.73 46.33,107.29 47.4,108.36 47.4,114.15 46.27,115.27 TR1.W2-COM 39.08,115.37 35.97,115.37 34.73,116.61 TR1.W2-COM1 32.15,118.57 26.51,118.57 TR1.W3-COM1 25.68,118.45 TR1.W3-COM 22.42,118.21 C25.2
  Bottom 1.016: R7.1 85.9,117.3 87.33,118.72 87.33,125.12 U$3.P$1 | SW2.1 81.23,121.16 R7.2 | C27.- 44.15,103.53 v43.13,104.55 | v53.8,87.33 57,87.33 58.06,86.26 v58.06,84.58
  Bottom 1.27: R7.1 83.77,120.09 83.77,122.94 R22.2
GND_OUT  (via drill 0.3 pad 1.68)
  Top 0.305: C11.1 18.44,72.43 18.44,71.63 23.38,71.63 23.38,70.1 | 23.38,70.1 DD2.18 23.38,65.02 | DD2.21 25.33,70.1 | 25.33,70.1 23.38,70.1 | DD2.26 28.58,70.1 | 28.58,70.1 27.93,70.1 | 27.93,70.1 25.98,70.1 | 25.98,70.1 25.33,70.1 | DD2.25 27.93,70.1 | 28.58,70.1 31.85,70.1 31.85,69.8 34.38,69.8 DD4.4 | DD2.7 25.98,70.1 | C13.2 22.49,65.02 23.38,65.02 | 23.38,65.02 C14.2
  Top 0.406: 16.61,66.27 C12.1 16.61,64.47 | 23.38,65.02 23.38,63.4 16.61,63.4 16.61,64.47 | 16.61,64.47 v14.94,64.47 | C21.2 35.66,83.68 35.66,84.58 38.56,84.58 DD3.2 38.56,81.53 37.34,80.31 C28.2 | U$1.GND 9.32,86.23 9.6,85.8 9.6,81.23 9.14,80.62 v9.14,78.79 | C28.2 36.42,78.94 35.51,78.03 33.16,78.03 C19.2 | R31.2 37.81,77.1 37.34,77.57 C28.2
  Top 0.61: C22.2 | C22.2 30.64,82.75 DA1.B | C22.2 32.76,82.61 C21.2
  Top 0.813: VD1.A 27.64,92.36 17.88,92.36 VD2.A 15.54,90.53 14.94,90.53 | v14.94,83.36 14.94,90.53 | 14.94,90.53 13.11,92.35 v10.06,92.35
  Bottom 0.61: VD2.A 17.73,92.51 VT5.E 20.5,90.41 R26.1 | 27.69,92.36 VD1.A | VT4.E 30.86,90.67 R24.1 | C17.2 22.5,86.2 C16.2 23.43,84.47 25.15,82.75 DA1.B | C15.2 14.33,66.9
  Bottom 0.813: v14.94,83.36 14.94,83.21 14.33,82.3 14.33,66.9 14.33,65.38 v14.94,64.47 | v10.06,92.35 9.14,92.35 v9.14,78.79 | VT4.E 27.74,92.36 VD1.A | VD2.A 18.18,92.06 C23.2 18.44,89.19 18.44,87.94 20.12,86.26 C17.2
IDAC_HIGH  (via drill 0.3 pad 1.68)
  Top 0.406: DD1.11 70,95.4 69.19,95.4 67.97,94.03 v66.14,94.03
  Bottom 0.406: 66.9,105.02 66.9,103.39 R4.2 66.48,102.14 65.99,101.65 64.77,101.65 63.86,100.74 63.86,97.69 65.23,96.16 v66.14,94.03
  Bottom 0.61: 66.9,105.02 R2.2
IDAC_LOW  (via drill 0.3 pad 1.68)
  Top 0.406: DD1.12 71.86,93.57 71.48,93.57 69.34,91.44 64.16,91.44 62.94,92.66 61.42,92.66 v60.05,94.03
  Bottom 0.406: v60.05,94.03 59.28,94.79 59.28,103.48 60.66,104.85 60.66,106.53 60.95,106.83 R5.2
  Bottom 0.61: R3.2 62.74,106.93 R5.2
LOAD
  Bottom 0.813: R9.2 67.26,122.02 67.21,122.07
  Bottom 1.016: U$2.P$1 67.21,122.07 67.21,125.73 VT1.D
N$1
  Top 0.406: DD1.33 83.64,103.42 C5.2
N$2
  Bottom 1.016: VT1.S 75.23,125.88 R22.1 75.94,121.62 SW1.2
  Bottom 1.27: 75.94,121.31 SW1.2 76.25,117.3 R7.4
N$3
  Top 0.406: R8.1 78.13,113.64 78.79,114.3 78.79,117.2 R7.3
  Bottom 1.27: R7.3 78.69,119.23 78.94,119.48 78.94,121.16 SW1.1
N$4
  Bottom 0.61: R15.1 12.19,47.94 LED1.A
N$5
  Bottom 0.61: VT2.C 12.05,21.13 LED1.K
N$6
  Bottom 0.61: R17.1 37.37,40.27 R16.2 35.26,40.32 VT2.B
N$7
  Top 0.406: 11.89,70.41 R18.1 12.04,71.27 12.04,80.92 11.43,81.53 11.43,87.41 10.21,88.63 U$1.D-
N$8
  Top 0.305: C11.2 22.08,70.73 DD2.16
  Top 0.406: R18.2 16.61,70.51 C11.2
N$9
  Bottom 0.61: 49.54,4.01 C9.1 47.44,4.12 GLCD1.VLCD
N$10
  Top 0.406: 11.84,67.87 R19.1 | 11.84,67.97 R19.1 | U$1.D+ 9.86,87.83 10.52,87.17 10.52,80.31 10.97,79.86 10.97,73 9.91,71.93 9.91,68.43 10.36,67.97 11.79,67.97 R19.1
N$11
  Top 0.305: C12.2 21.43,67.91 DD2.15
  Top 0.406: R19.2 C12.2
N$12
  Top 0.305: DD4.3 36.12,71.09 36.12,75.59 29.88,75.59 DD2.1
N$13
  Top 0.305: DD4.2 27.28,72.36 DD2.5
N$15  (via drill 0.3 pad 1.68)
  Top 0.305: DD2.14 21.43,77.42 18.9,77.42 18.9,74.22 v18.75,74.22
  Bottom 0.61: R21.2 17.46,74.89 v18.75,74.22
N$16
  Bottom 0.61: R20.2 VT3.1 16.49,76.67 R21.1 15.7,77.3 15.7,80.92 16.61,81.84 18.14,81.84 19.25,80.72 C18.1
N$17
  Top 0.406: C21.1 33.83,87.48 38.56,87.48 | 38.56,87.48 DD3.5 | OK1.5 48.16,80.16 42.98,80.16 42.98,87.48 38.56,87.48
  Top 0.61: DA1.E 26.61,86.05 C22.1 33.17,86.05 C21.1
N$18
  Bottom 0.61: VT4.B 33.86,90.36 R24.2 35.47,89.86 R23.2
N$19  (via drill 0.3 pad 1.68)
  Top 0.61: v12.65,107.9 11.43,109.12 11.43,127.71 46.63,127.71 48.92,125.42 48.92,108.97 53.34,104.55 55.17,104.55 56.76,102.96 R37.1 56.76,95.8 57,95.56 57,94.88 R34.1
  Bottom 0.61: SA5.SENSE 9.75,102.11 9.75,106.07 11.58,107.9 v12.65,107.9
N$20  (via drill 0.3 pad 6.45)  (3 unrouted)
  other vias: 5.49,65.68 5.49,123.9 93.88,123.9 93.88,65.68
N$21
  Bottom 0.61: VT5.B 23.5,90.62 R26.2 24.17,88.44 R25.2
N$22
  Bottom 0.813: VD3.A 39.15,111.91 TR1.W2-1
N$23
  Bottom 0.813: VD4.A 43.64,121.72 40.84,124.51 34.12,124.51 TR1.W2-2
N$24
  Bottom 0.813: TR1.W3-2 28.22,124.74 VD6.A
N$25
  Bottom 0.813: TR1.W3-1 20.35,113.37 VD5.A
N$26
  Bottom 0.813: VD4.C 53.8,112.12 VD3.C 54,107.9 L1.P$1
N$27
  Bottom 0.813: VD6.C 18.14,121.61 VD5.C 16.21,123.55 L2.P$1
N$28
  Bottom 0.61: R28.1 R27.2 49.23,95.39 49.83,94.79 49.83,92.86 DA2.E
N$29
  Bottom 0.61: R29.2 51.66,89.66 R30.1 50.7,89.34 OK1.1
N$30
  Bottom 0.61: DA2.C 44.6,90.42 45.42,89.61 48.63,89.61 R30.2 48.16,89.14 OK1.2
N$31
  Top 0.406: OK1.4 44.77,77.53 R32.2 41.91,77.48 41.67,77.48 40.84,76.66 39.56,76.66 R31.1
  Bottom 0.61: OK1.4 45.62,75.39 R33.1
N$32
  Bottom 0.61: OK1.6 50.7,75.39 R33.3 R33.2
N$33
  Bottom 0.61: VT6.B 2.61,108.97 R35.2 2.79,109.18 R36.2
N$34
  Bottom 0.61: VD7.A 3.71,96.93 SA5.GND 3.71,104.06 VT6.C
N$35  (via drill 0.3 pad 6.45)
  other vias: 4.72,48.77
N$36  (via drill 0.3 pad 6.45)
  other vias: 4.72,9.91
N$37  (via drill 0.3 pad 6.45)
  other vias: 91.59,9.91
N$38  (via drill 0.3 pad 6.45)
  other vias: 91.59,48.77
OPAMP_OUT  (via drill 0.3 pad 1.68)
  Top 0.406: DD1.39 75.9,109.42 73,112.32 73,115.37 71.63,116.74 62.94,116.74 61.26,118.42 v61.26,118.57
  Bottom 0.406: R6.2 64.31,118.88 61.58,118.88 v61.26,118.57
OPAMP_POS  (via drill 0.3 pad 1.68)
  Top 0.406: DD1.37 77.5,101.27 72.39,96.17 72.39,95.56 70.41,94.03 68.88,92.51 64.47,92.51 63.86,93.12 63.86,94.64 v63.7,94.79
  Bottom 0.406: 62.68,104.85 64.82,104.85 C7.1 64.78,105.17 R4.1 64.41,102.97 62.48,101.04 62.48,96.01 v63.7,94.79
  Bottom 0.61: 62.68,104.85 R5.1
PWM1  (via drill 0.3 pad 1.68)
  Top 0.406: v35.66,81.08 36.42,81.08 37.64,82.3 37.64,83.4 DD3.1
  Bottom 0.61: R25.1 30.63,88.44 30.63,80.47 35.66,80.47 v35.66,81.08
PWM1PWR
  Bottom 0.61: VT5.C 22,98.4 VD2.C 23.65,102.77 TR1.W1-1
  pour Bottom (no thermals): 25.45,94.03 19.66,94.03 19.05,94.64 14.78,94.64 14.78,101.19 16.15,101.19 16.76,100.58 19.51,100.58 20.27,101.35 25.45,101.35
PWM2  (via drill 0.3 pad 1.68)
  Top 0.406: v40.23,81.38 39.51,81.38 DD3.3
  Bottom 0.61: R23.1 40.23,89.97 v40.23,81.38
PWM2PWR
  Bottom 0.61: VT4.C 32.36,97.79 VD1.C 34.8,102.46 37.8,105.46 37.8,107.92 TR1.W1-2
  pour Bottom (no thermals): 32.46,93.73 31.55,94.18 26.82,94.18 26.67,94.34 26.67,100.43 29.41,100.43 30.48,101.5 40.39,101.5 40.39,93.73
QUADRATURE_A
  Top 0.406: DD1.24 82.85,96.22 83.82,95.25 86.72,95.25 88.09,96.47 90.68,96.47 SA3.4
QUADRATURE_B
  Top 0.406: DD1.25 83.27,97.02 84.12,96.16 85.8,96.16 87.63,97.99 91.85,97.99 SA3.5
QUADRATURE_BUTTON
  Top 0.406: DD1.23 82.28,95.42 83.21,94.49 90.27,94.49 SA3.3
REF_OUT  (via drill 0.3 pad 1.68)
  Top 0.406: DD1.40 75.1,108.85 72.09,111.86 72.09,113.84 71.17,114.91 v65.68,114.91
  Bottom 0.406: SA1.P$1 58.37,122.99 59.13,122.22 59.13,116.43 60.96,114.91 v65.68,114.91
SWDCLK
  Top 0.406: SA4.4 70.87,88.54 73.46,91.14 73.46,93.5 DD1.14
SWDIO
  Top 0.406: DD1.13 72.7,92.2 70.41,89.92 66.2,89.92 SA4.2
TEMPERATURE  (via drill 0.3 pad 1.68)
  Top 0.406: DD1.3 63.11,101.82 61.87,100.58 60.5,100.58 59.28,101.8 59.28,103.48 60.66,104.85 60.66,111.1 v58.98,112.78
  Bottom 0.406: R11.2 59.1,112.65 v58.98,112.78 57.61,114.15 57.61,121.61 55.73,123.5 SA2.P$1
UART_RX  (via drill 0.3 pad 1.68)
  Top 0.406: DD4.6 40.77,71.09 42.82,69.04 56.54,69.04 v57.76,69.95 | DD1.20 78.3,87.78 76.96,87.78 76.96,84.73 71.78,84.73 69.95,82.91 59.74,82.91 57.76,80.92 v57.76,73.3
  Bottom 0.406: v57.76,69.95 v57.76,73.3
UART_TX
  Top 0.406: DD4.7 41.17,72.36 43.28,70.26 55.17,70.26 56.54,71.63 59.13,71.63 59.89,72.39 59.89,75.13 58.98,76.05 58.98,80.62 59.74,81.38 70.56,81.38 72.39,83.21 78.03,83.21 78.03,86.87 79.1,86.87 DD1.21
VBUS  (via drill 0.3 pad 1.68)
  Top 0.305: DD2.20 24.68,66.45 25.6,66.45 25.6,65.02
  Top 0.406: v12.65,63.86 12.65,62.48 25.6,62.48 25.6,65.02 C14.1 | 12.04,89.31 v12.19,89.46 12.19,89.43 U$1.VBUS
  Top 0.61: v17.53,79.4 15.24,79.4 12.65,81.99 12.65,89 v12.19,89.46
  Bottom 0.61: VT3.2 19.3,78.57 R20.1 18.56,78.37 v17.53,79.4 | C15.1 12.5,66.9 12.65,66.75
  Bottom 0.813: v12.65,63.86 12.65,66.75 12.65,89 v12.19,89.46
VBUS_COM
  Bottom 0.61: C17.1 C16.1 22.54,82.77 23.16,82.14 23.16,80.94 C18.2 | C18.2 23.83,80.72 24.23,80.31 25.76,80.31 DA1.C | VT3.3 23.55,79.47 23.16,79.86 23.16,80.5 C18.2
  Bottom 0.813: TR1.W1-COM1 33.78,105.75 TR1.W1-COM 30.92,108.53 29.87,109.58 21.79,109.58 19.05,106.83 16.31,106.83 12.95,103.48 12.95,93.27 14.74,91.48 C23.1 14.74,85.65 16.31,85.65 19.19,82.76 C17.1
VDD  (via drill 0.3 pad 1.68)  (1 unrouted)
  Top 0.406: C20.1 37.8,67.56 37.8,73.61 39.58,73.61 DD4.8 42.34,73.64 44.5,71.48 54.41,71.48 55.78,72.85 55.78,84.28 v55.17,84.89 | v76.81,90.53 77.5,91.21 DD1.19 77.5,95.33 77.57,95.4 79.71,95.4 | C6.1 81.9,93.36 79.86,95.4 79.71,95.4 | 86.41,105.65 R1.2 86.56,105.7 86.56,107.29 v88.39,109.12 86.26,111.25 82.91,111.25 82.16,110.5 C3.2 82.16,108.52 79.9,106.26 DD1.34 79.86,105.26 79.86,95.56 79.71,95.4 | DD1.35 79.1,106.83 79.86,107.59 79.86,109.05 C2.2 79.74,110.53 v80.77,111.56 | SA4.1 56.95,89.81 v55.78,90.98 | SA6.6 77.52,67.36 82.75,67.36 82.75,76.96 v82.45,76.96
  Top 0.61: v37.49,18.9 v46.94,18.9 v53.34,18.9 | v55.17,84.89 56.39,86.11 56.39,88.7 55.78,89.31 v55.78,90.98 57.05,92.25 R34.2
  Bottom 0.406: v76.81,90.53 56.24,90.53 v55.78,90.98 | C30.2 68.48,77.01 68.43,76.96 | C29.2 80.25,112.08 v80.77,111.56 | C1.2 79.84,107.12 81.84,109.12 v88.39,109.12
  Bottom 0.61: SA7.6 46.28,38.1 49.99,38.1 49.99,29.11 | 49.99,29.11 49.99,25.15 48.46,25.15 48.46,21.64 | 48.46,21.64 48.46,18.9 | 48.46,18.9 48.46,10.97 43.74,7.47 43.74,4.11 GLCD1.VDD | R14.2 50.39,29.52 49.99,29.11 | R13.2 48.41,21.69 48.46,21.64 | 48.46,18.9 v46.94,18.9 | C10.1 35.66,18.9 v37.49,18.9 37.44,18.85 R12.2 | 52.58,92.8 R29.1 | 50.6,103.53 54.51,103.53 57.15,100.89 57.15,92.35 v55.78,90.98 | v55.17,84.89 55.17,78.94 58.98,75.13 64.16,75.13 | 64.16,75.13 66.6,76.96 68.43,76.96 v82.45,76.96 87.78,76.96 92.81,81.99 97.08,81.99 97.08,109.12 v88.39,109.12 88.39,110.8 86.72,112.47 81.69,112.47 v80.77,111.56 | R15.2 23.77,40.58 23.77,44.5 55.93,44.5 55.93,18.9 v53.34,18.9 | VD9.C 64.16,75.13
  Bottom 0.813: 50.09,100.74 50.09,99.11 51.25,97.95 R27.1 51.21,97.03 51.21,95.1 52.58,93.73 52.58,92.8 | 50.09,100.74 C27.+ 50.6,103.53 54.2,99.92 L1.P$2 | C24.1 50.09,100.74
VOLTAGE_SENSE  (via drill 0.3 pad 1.68)
  Top 0.406: DD1.5 66.84,100.22 v65.53,99.36
  Bottom 0.406: R9.1 67.4,118.44 R10.1 67.67,112.47 68.43,111.71 68.43,102.41 | 68.43,102.41 v65.53,99.36 | VD8.C 70.71,100.13 68.43,102.41
XRES  (via drill 0.3 pad 1.68)
  Top 0.406: DD1.32 86.31,102.62 86.56,102.87 86.56,103.8 R1.1 86.5,103.94 v89.15,103.94 | SA4.10 v69.34,84.73
  Bottom 0.406: v89.15,103.94 94.34,103.94 94.34,84.73 v69.34,84.73